# EAGLE design sequencer (EAGLE 5.11)
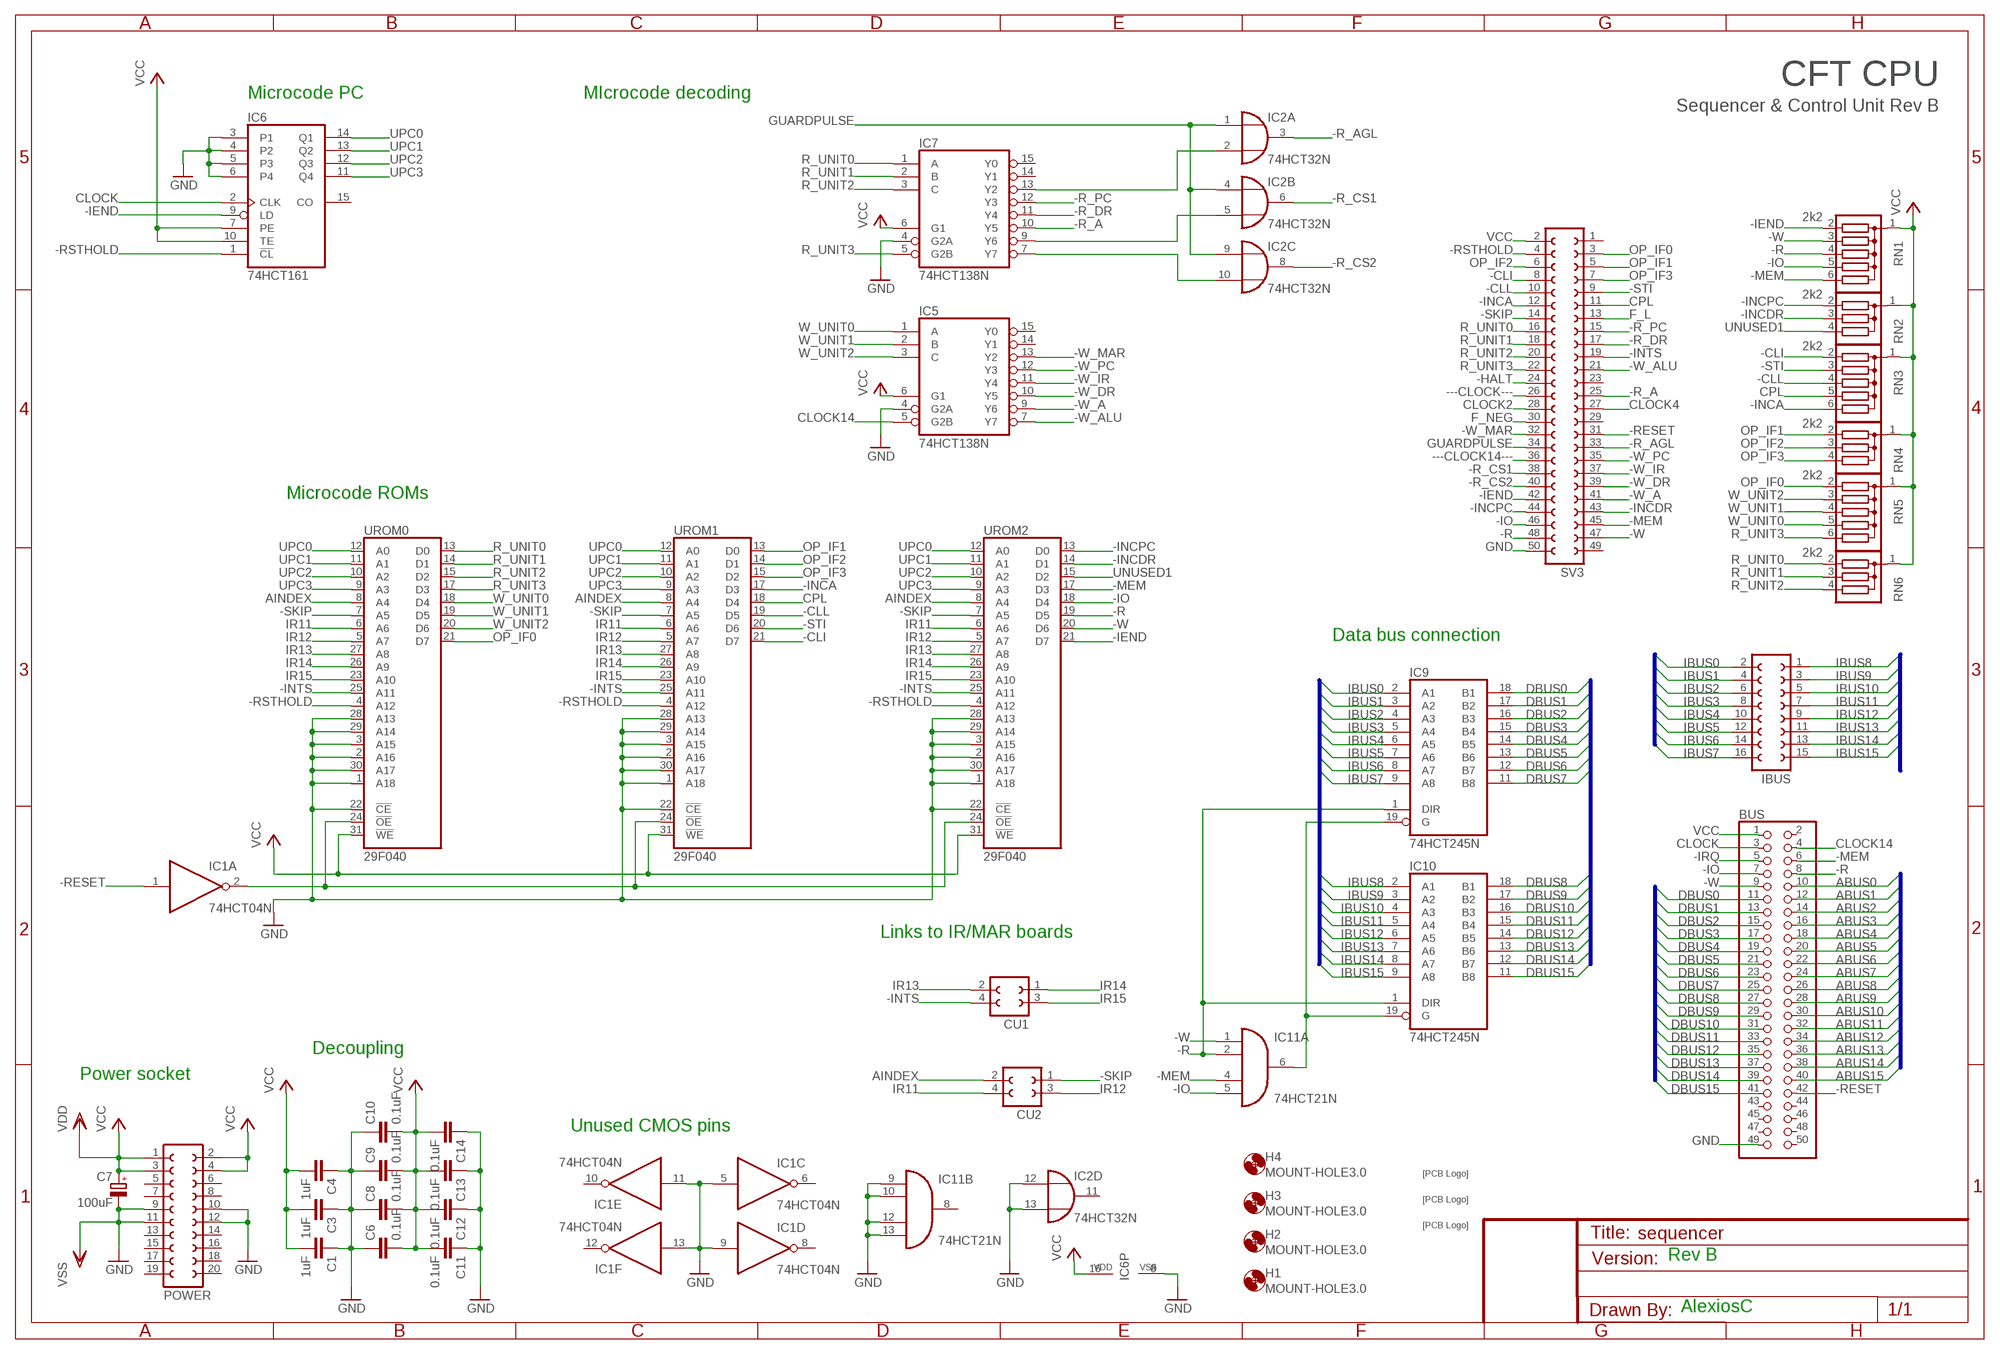
[diagram p0: schematic, sheet 1]

## Parts
BUS  PINHD-2X25/90  [2X25/90]
C1  1uF  C-EU025-025X050  [C025-025X050]
C3  1uF  C-EU025-025X050  [C025-025X050]
C4  1uF  C-EU025-025X050  [C025-025X050]
C6  0.1uF  C-EU025-025X050  [C025-025X050]
C7  100uF  CPOL-EUE2.5-6  [E2,5-6]
C8  0.1uF  C-EU025-025X050  [C025-025X050]
C9  0.1uF  C-EU025-025X050  [C025-025X050]
C10  0.1uF  C-EU025-025X050  [C025-025X050]
C11  0.1uF  C-EU025-025X050  [C025-025X050]
C12  0.1uF  C-EU025-025X050  [C025-025X050]
C13  0.1uF  C-EU025-025X050  [C025-025X050]
C14  0.1uF  C-EU025-025X050  [C025-025X050]
CU1  FE02-2  [FE02-2]
CU2  FE02-2  [FE02-2]
H1  MOUNT-HOLE3.0  [3,0]
H2  MOUNT-HOLE3.0  [3,0]
H3  MOUNT-HOLE3.0  [3,0]
H4  MOUNT-HOLE3.0  [3,0]
IBUS  FE08-2  [FE08-2]
IC1  74HCT04N  [DIL14]
IC2  74HCT32N  [DIL14]
IC5  74HCT138N  [DIL16]
IC6  74HCT161  4161P  [DIL16]
IC7  74HCT138N  [DIL16]
IC9  74HCT245N  [DIL20]
IC10  74HCT245N  [DIL20]
IC11  74HCT21N  [DIL14]
POWER  FE10-2  [FE10-2]
RN1  2k2  G05R  [SIL6]
RN2  2k2  G03R  [SIL4]
RN3  2k2  G05R  [SIL6]
RN4  2k2  G03R  [SIL4]
RN5  2k2  G05R  [SIL6]
RN6  2k2  G03R  [SIL4]
SV3  FE25-2  [FE25-2]
U$1  SIGNATUREPLANE  [SIGNATURE_PLANE]
U$2  SIGNATUREPLANE  [SIGNATURE_PLANE]
U$3  SIGNATURESILK  [SIGNATURE]
UROM0  29F040  29F040DIP32  [DIL32]
UROM1  29F040  29F040DIP32  [DIL32]
UROM2  29F040  29F040DIP32  [DIL32]

## Nets
---CLOCK14---: SV3.36
---CLOCK---: SV3.26
-CLI: RN3.2 SV3.8 UROM1.21(D7)
-CLL: RN3.4 SV3.10 UROM1.19(D5)
-HALT: SV3.24
-IEND: IC6.9(LD) RN1.2 SV3.42 UROM2.21(D7)
-INCA: RN3.6 SV3.12 UROM1.17(D3)
-INCDR: RN2.3 SV3.43 UROM2.14(D1)
-INCPC: RN2.2 SV3.44 UROM2.13(D0)
-INTS: CU1.4 SV3.19 UROM0.25(A11) UROM1.25(A11) UROM2.25(A11)
-IO: BUS.7 IC11.5(A:I3) RN1.5 SV3.46 UROM2.18(D4)
-IRQ: BUS.5
-MEM: BUS.6 IC11.4(A:I2) RN1.6 SV3.45 UROM2.17(D3)
-R: BUS.8 IC9.1(DIR) IC10.1(DIR) IC11.2(A:I1) RN1.4 SV3.48 UROM2.19(D5)
-R_A: IC7.10(Y5) SV3.25
-R_AGL: IC2.3(A:O) SV3.33
-R_CS1: IC2.6(B:O) SV3.38
-R_CS2: IC2.8(C:O) SV3.40
-R_DR: IC7.11(Y4) SV3.17
-R_PC: IC7.12(Y3) SV3.15
-RESET: BUS.42 IC1.1(A:I) SV3.31
-RSTHOLD: IC6.1(!CL) SV3.4 UROM0.4(A12) UROM1.4(A12) UROM2.4(A12)
-SKIP: CU2.1 SV3.14 UROM0.7(A5) UROM1.7(A5) UROM2.7(A5)
-STI: RN3.3 SV3.9 UROM1.20(D6)
-W: BUS.9 IC11.1(A:I0) RN1.3 SV3.47 UROM2.20(D6)
-W_A: IC5.9(Y6) SV3.41
-W_ALU: IC5.7(Y7) SV3.21
-W_DR: IC5.10(Y5) SV3.39
-W_IR: IC5.11(Y4) SV3.37
-W_MAR: IC5.13(Y2) SV3.32
-W_PC: IC5.12(Y3) SV3.35
ABUS0: BUS.10
ABUS1: BUS.12
ABUS2: BUS.14
ABUS3: BUS.16
ABUS4: BUS.18
ABUS5: BUS.20
ABUS6: BUS.22
ABUS7: BUS.24
ABUS8: BUS.26
ABUS9: BUS.28
ABUS10: BUS.30
ABUS11: BUS.32
ABUS12: BUS.34
ABUS13: BUS.36
ABUS14: BUS.38
ABUS15: BUS.40
AINDEX: CU2.2 UROM0.8(A4) UROM1.8(A4) UROM2.8(A4)
CLOCK: BUS.3 IC6.2(CLK)
CLOCK2: SV3.28
CLOCK4: SV3.27
CLOCK14: BUS.4 IC5.5(G2B)
CPL: RN3.5 SV3.11 UROM1.18(D4)
DBUS0: BUS.11 IC9.18(B1)
DBUS1: BUS.13 IC9.17(B2)
DBUS2: BUS.15 IC9.16(B3)
DBUS3: BUS.17 IC9.15(B4)
DBUS4: BUS.19 IC9.14(B5)
DBUS5: BUS.21 IC9.13(B6)
DBUS6: BUS.23 IC9.12(B7)
DBUS7: BUS.25 IC9.11(B8)
DBUS8: BUS.27 IC10.18(B1)
DBUS9: BUS.29 IC10.17(B2)
DBUS10: BUS.31 IC10.16(B3)
DBUS11: BUS.33 IC10.15(B4)
DBUS12: BUS.35 IC10.14(B5)
DBUS13: BUS.37 IC10.13(B6)
DBUS14: BUS.39 IC10.12(B7)
DBUS15: BUS.41 IC10.11(B8)
F_L: SV3.13
F_NEG: SV3.30
GND: BUS.49 C1.1 C3.1 C4.1 C6.1 C7.- C8.1 C9.1 C10.1 C11.1 C12.1 C13.1 C14.1 IC1.5(C:I) IC1.9(D:I) IC1.11(E:I) IC1.13(F:I) IC2.12(D:I0) IC2.13(D:I1) IC5.4(G2A) IC6.3(P1) IC6.4(P2) IC6.5(P3) IC6.6(P4) IC6.8(VSS) IC7.4(G2A) IC11.9(B:I0) IC11.10(B:I1) IC11.12(B:I2) IC11.13(B:I3) POWER.9 POWER.10 POWER.11 POWER.12 SV3.50 UROM0.1(A18) UROM0.2(A16) UROM0.3(A15) UROM0.22(!CE) UROM0.28(A13) UROM0.29(A14) UROM0.30(A17) UROM1.1(A18) UROM1.2(A16) UROM1.3(A15) UROM1.22(!CE) UROM1.28(A13) UROM1.29(A14) UROM1.30(A17) UROM2.1(A18) UROM2.2(A16) UROM2.3(A15) UROM2.22(!CE) UROM2.28(A13) UROM2.29(A14) UROM2.30(A17) ; supply symbol labelled VSS
GUARDPULSE: IC2.1(A:I0) IC2.4(B:I0) IC2.9(C:I0) SV3.34
IBUS0: IBUS.2 IC9.2(A1)
IBUS1: IBUS.4 IC9.3(A2)
IBUS2: IBUS.6 IC9.4(A3)
IBUS3: IBUS.8 IC9.5(A4)
IBUS4: IBUS.10 IC9.6(A5)
IBUS5: IBUS.12 IC9.7(A6)
IBUS6: IBUS.14 IC9.8(A7)
IBUS7: IBUS.16 IC9.9(A8)
IBUS8: IBUS.1 IC10.2(A1)
IBUS9: IBUS.3 IC10.3(A2)
IBUS10: IBUS.5 IC10.4(A3)
IBUS11: IBUS.7 IC10.5(A4)
IBUS12: IBUS.9 IC10.6(A5)
IBUS13: IBUS.11 IC10.7(A6)
IBUS14: IBUS.13 IC10.8(A7)
IBUS15: IBUS.15 IC10.9(A8)
IR11: CU2.4 UROM0.6(A6) UROM1.6(A6) UROM2.6(A6)
IR12: CU2.3 UROM0.5(A7) UROM1.5(A7) UROM2.5(A7)
IR13: CU1.2 UROM0.27(A8) UROM1.27(A8) UROM2.27(A8)
IR14: CU1.1 UROM0.26(A9) UROM1.26(A9) UROM2.26(A9)
IR15: CU1.3 UROM0.23(A10) UROM1.23(A10) UROM2.23(A10)
N$1: IC1.2(A:O) UROM0.24(!OE) UROM1.24(!OE) UROM2.24(!OE)
N$2: IC9.19(G) IC10.19(G) IC11.6(A:O)
N$3: IC2.2(A:I1) IC7.13(Y2)
N$4: IC2.5(B:I1) IC7.9(Y6)
N$7: IC2.10(C:I1) IC7.7(Y7)
OP_IF0: RN5.2 SV3.3 UROM0.21(D7)
OP_IF1: RN4.2 SV3.5 UROM1.13(D0)
OP_IF2: RN4.3 SV3.6 UROM1.14(D1)
OP_IF3: RN4.4 SV3.7 UROM1.15(D2)
R_UNIT0: IC7.1(A) RN6.2 SV3.16 UROM0.13(D0)
R_UNIT1: IC7.2(B) RN6.3 SV3.18 UROM0.14(D1)
R_UNIT2: IC7.3(C) RN6.4 SV3.20 UROM0.15(D2)
R_UNIT3: IC7.5(G2B) RN5.6 SV3.22 UROM0.17(D3)
UNUSED1: RN2.4 UROM2.15(D2)
UPC0: IC6.14(Q1) UROM0.12(A0) UROM1.12(A0) UROM2.12(A0)
UPC1: IC6.13(Q2) UROM0.11(A1) UROM1.11(A1) UROM2.11(A1)
UPC2: IC6.12(Q3) UROM0.10(A2) UROM1.10(A2) UROM2.10(A2)
UPC3: IC6.11(Q4) UROM0.9(A3) UROM1.9(A3) UROM2.9(A3)
VCC: BUS.1 C1.2 C3.2 C4.2 C6.2 C7.+ C8.2 C9.2 C10.2 C11.2 C12.2 C13.2 C14.2 IC5.6(G1) IC6.7(PE) IC6.10(TE) IC6.16(VDD) IC7.6(G1) POWER.1 POWER.2 POWER.3 POWER.4 RN1.1 RN2.1 RN3.1 RN4.1 RN5.1 RN6.1 SV3.2 UROM0.31(!WE) UROM1.31(!WE) UROM2.31(!WE) ; supply symbol labelled VDD
W_UNIT0: IC5.1(A) RN5.5 UROM0.18(D4)
W_UNIT1: IC5.2(B) RN5.4 UROM0.19(D5)
W_UNIT2: IC5.3(C) RN5.3 UROM0.20(D6)
Unconnected: BUS.2 BUS.43 BUS.44 BUS.45 BUS.46 BUS.47 BUS.48 BUS.50 IC1.3(B:I) IC1.4(B:O) IC1.6(C:O) IC1.8(D:O) IC1.10(E:O) IC1.12(F:O) IC2.11(D:O) IC5.14(Y1) IC5.15(Y0) IC6.15(CO) IC7.14(Y1) IC7.15(Y0) IC11.8(B:O) POWER.5 POWER.6 POWER.7 POWER.8 POWER.13 POWER.14 POWER.15 POWER.16 POWER.17 POWER.18 POWER.19 POWER.20 SV3.1 SV3.23 SV3.29 SV3.49

## Buses
ABUS[0..15]
DBUS[0..15]
IBUS[0..15]

## Notes on the sheet
- CFT CPU
- Microcode PC | MIcrocode decoding
- Sequencer & Control Unit Rev B
- Microcode ROMs
- Data bus connection
- Links to IR/MAR boards
- Decoupling
- Power socket
- Unused CMOS pins
- Rev B
- AlexiosC

## Power pins joined to a net without a drawn wire
GND: IC1.7(P:GND) IC2.7(P:GND) IC5.8(GND) IC7.8(GND) IC9.10(GND) IC10.10(GND) IC11.7(P:GND) UROM0.16(GND) UROM1.16(GND) UROM2.16(GND)
VCC: IC1.14(P:VCC) IC2.14(P:VCC) IC5.16(VCC) IC7.16(VCC) IC9.20(VCC) IC10.20(VCC) IC11.14(P:VCC) UROM0.32(VCC) UROM1.32(VCC) UROM2.32(VCC)

## Library data of the parts
BUS = pinhead:PINHD-2X25: PIN HEADER
C1 C3 C4 C6 C8-C14 = rcl:C-EU: CAPACITOR, European symbol
C7 = rcl:CPOL-EU: POLARIZED CAPACITOR, European symbol
CU1 CU2 = alexios:FE02-2: A 2x2 pin female header.
H1-H4 = holes:MOUNT-HOLE: MOUNTING HOLE with drill center marker
IBUS = con-lsta:FE08-2: FEMALE HEADER
IC1 = 74xx-eu:74*04: Hex INVERTER
IC2 = 74xx-eu:74*32: Quad 2-input OR gate
IC5 IC7 = 74xx-eu:74*138: 3-line to 8-line DECODER/DEMULTIPLEXER
IC6 = 41xx:4161: 41xx DEVICE
IC9 IC10 = 74xx-eu:74*245: Octal BUS TRANSCEIVER, 3-state
IC11 = 74xx-eu:74*21: Dual 4-input AND gate
POWER = con-lsta:FE10-2: FEMALE HEADER; OC_FARNELL: unknown; OC_NEWARK: unknown
RN1 RN3 RN5 = resistor-sil:G05R: SIL RESISTOR; OC_FARNELL: unknown; OC_NEWARK: unknown
RN2 RN4 RN6 = resistor-sil:G03R: SIL RESISTOR; OC_FARNELL: unknown; OC_NEWARK: unknown
SV3 = con-lsta:FE25-2: FEMALE HEADER
U$1-U$3 = alexios:SIGNATURE: Soup signature
UROM0 UROM1 UROM2 = alexios:29F040: 4-mbit (512x8) Flash memory in a PLCC32 package (with socket). AM29F040 is an example of this.

## Net classes
0 default: width 0.406 mm, clearance 0.305 mm
1 Decoupling: width 1.27 mm

## Board
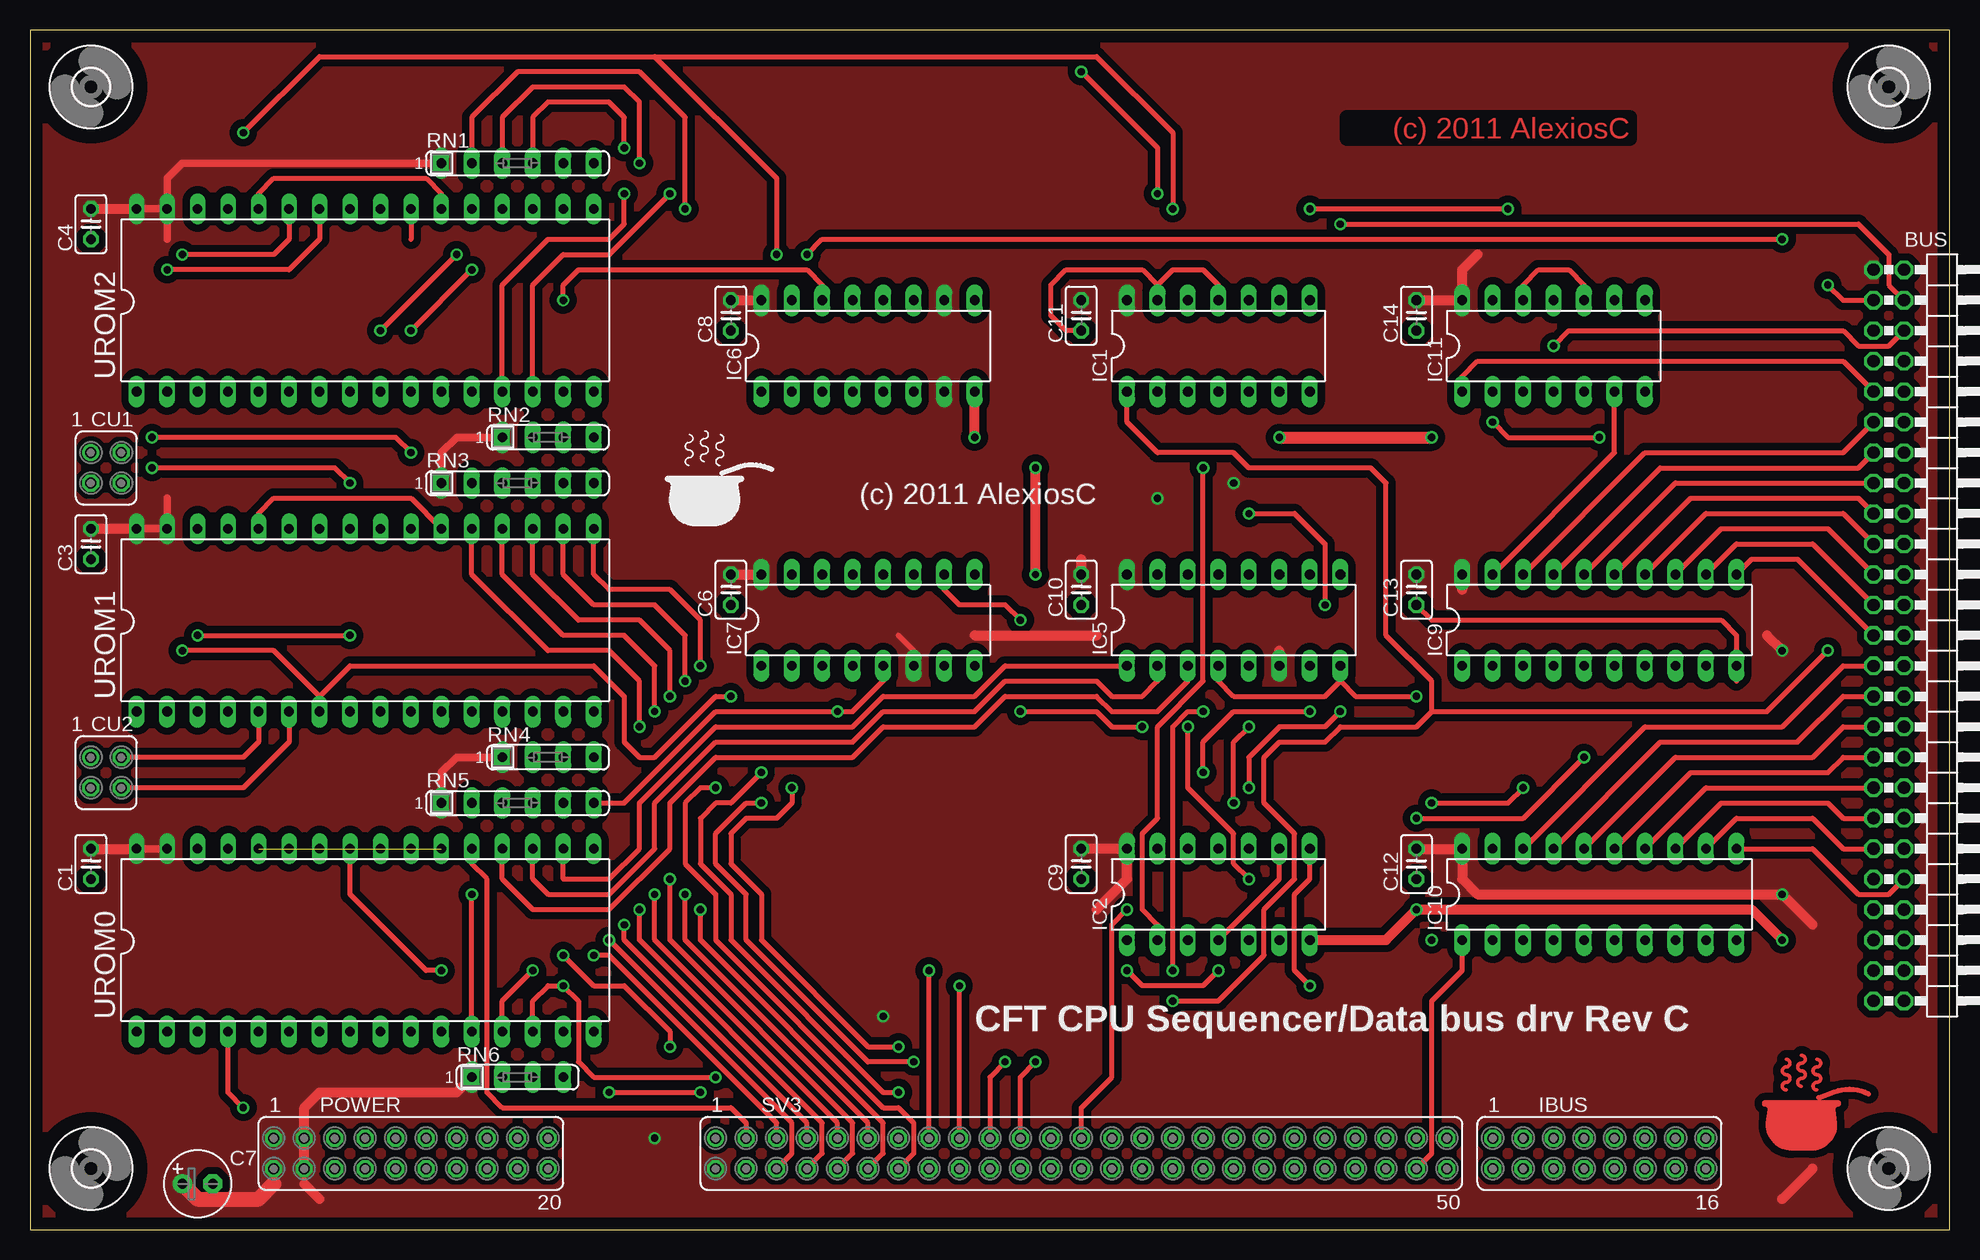
[diagram p1: board, top side]
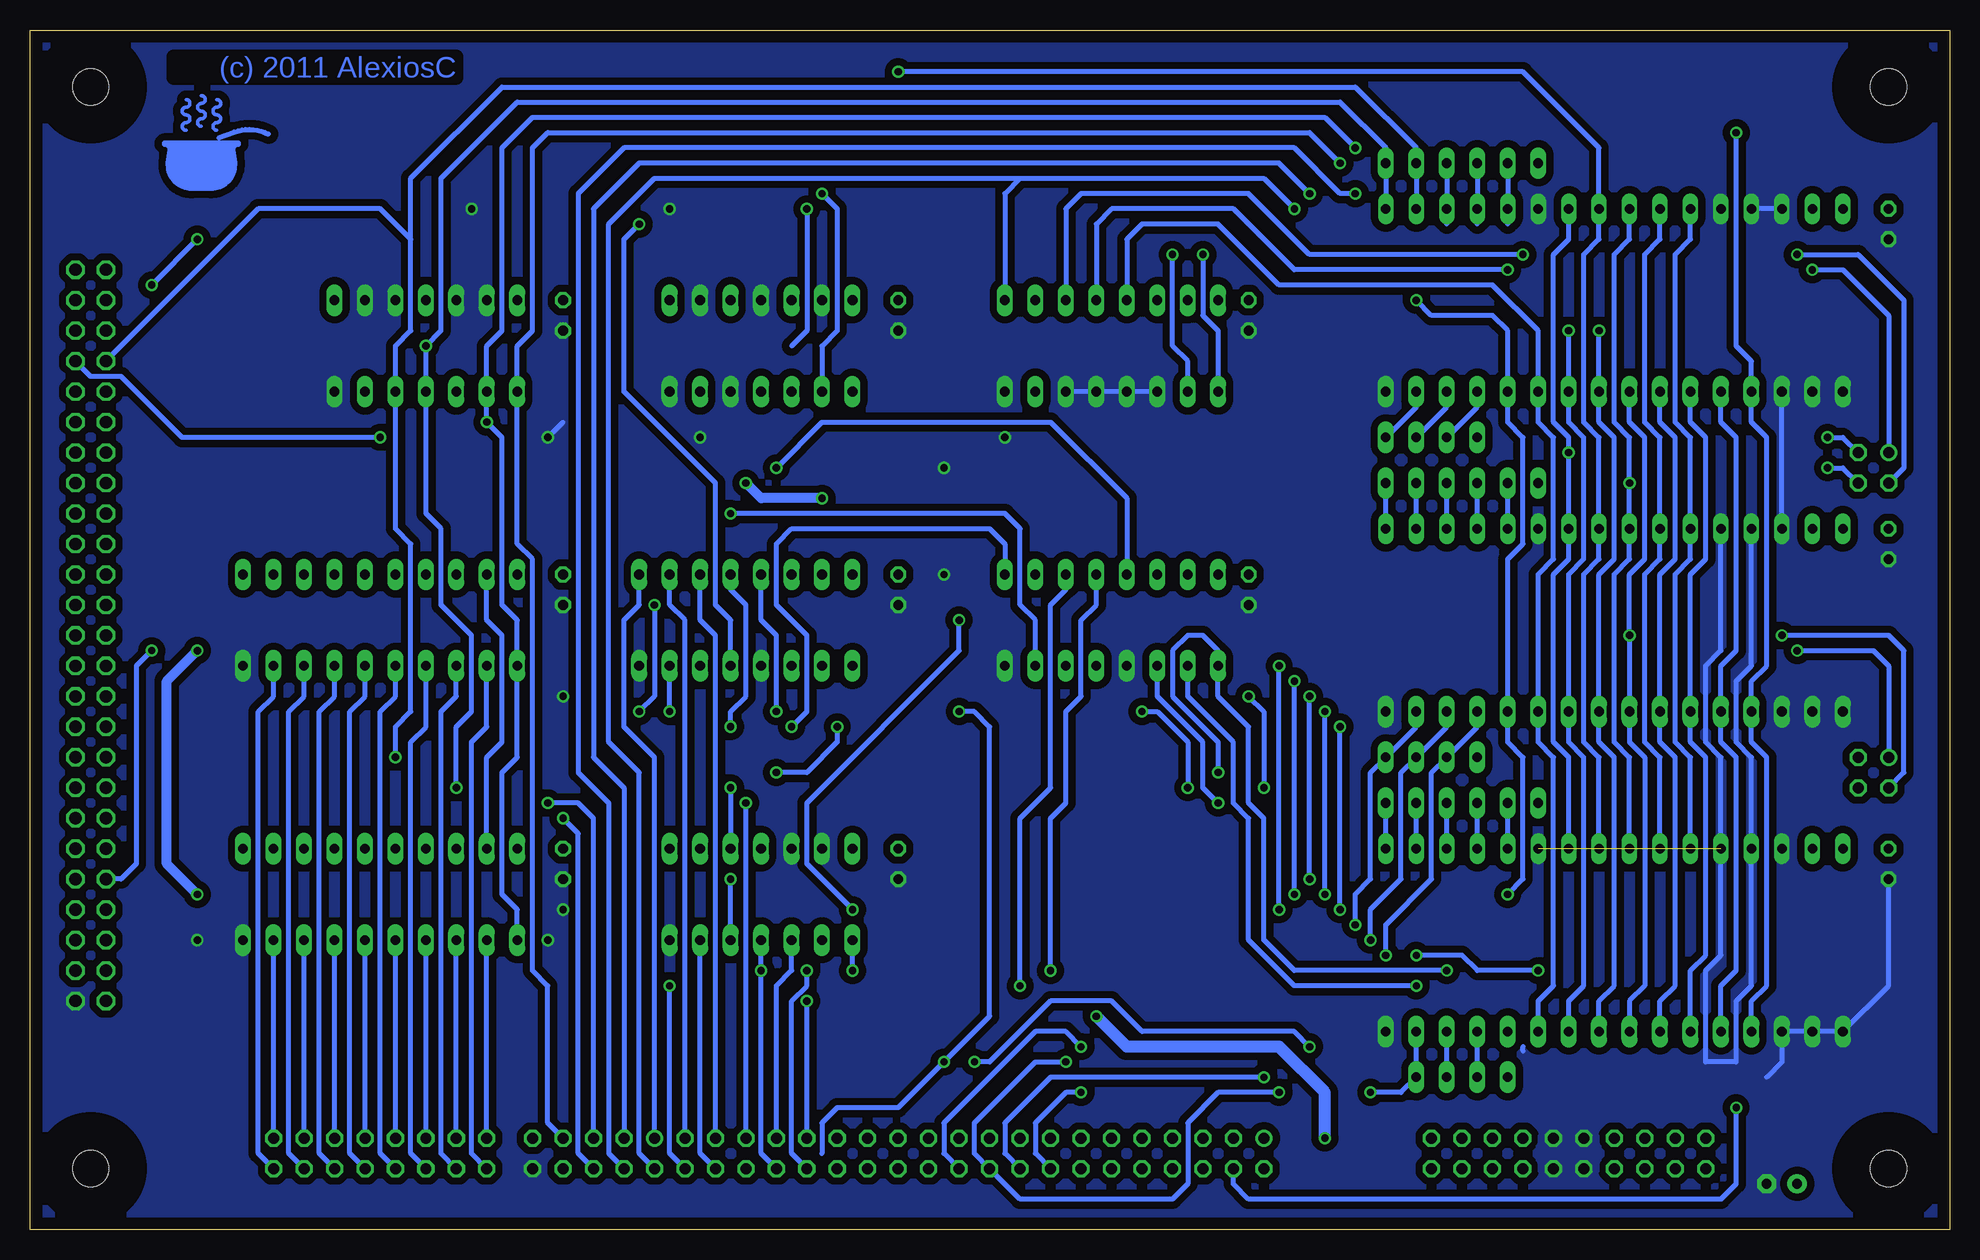
[diagram p2: board, bottom side, seen from below]

Size 160 x 100 mm. Coordinates in mm from the lower left corner, seen from the top.
Outline: 0,0 160,0 160,100 0,100 0,0
Copper layers (1*16): Top 0.035mm / dielectric 1.5mm / Bottom 0.035mm
Design rules "olimex-10mil": minimum track width 10mil, minimum drill 24mil, track to track 10mil, track to pad 10mil, pad to pad 10mil, via to via 10mil, smd to smd 10mil, copper to edge 40mil, drill to drill 10mil, minimum pad ring 10mil, minimum via ring 8mil, stop-mask expansion 0mil, vias tented up to drill 0mil, thermal gap 10mil

### Footprints (pad centres in the part's own frame; a part is rotated, then mirrored left to right if it is on the bottom)
2X25/90 = drill 1.016 octagon: 1 -29.21,-6.35; 2 -29.21,-3.81; 3 -26.67,-6.35; 4 -26.67,-3.81; 5 -24.13,-6.35; 6 -24.13,-3.81; 7 -21.59,-6.35; 8 -21.59,-3.81; 9 -19.05,-6.35; 10 -19.05,-3.81; 11 -16.51,-6.35; 12 -16.51,-3.81; 13 -13.97,-6.35; 14 -13.97,-3.81; 15 -11.43,-6.35; 16 -11.43,-3.81; 17 -8.89,-6.35; 18 -8.89,-3.81; 19 -6.35,-6.35; 20 -6.35,-3.81; 21 -3.81,-6.35; 22 -3.81,-3.81; 23 -1.27,-6.35; 24 -1.27,-3.81; 25 1.27,-6.35; 26 1.27,-3.81; 27 3.81,-6.35; 28 3.81,-3.81; 29 6.35,-6.35; 30 6.35,-3.81; 31 8.89,-6.35; 32 8.89,-3.81; 33 11.43,-6.35; 34 11.43,-3.81; 35 13.97,-6.35; 36 13.97,-3.81; 37 16.51,-6.35; 38 16.51,-3.81; 39 19.05,-6.35; 40 19.05,-3.81; 41 21.59,-3.81; 42 21.59,-6.35; 43 24.13,-3.81; 44 24.13,-6.35; 45 26.67,-3.81; 46 26.67,-6.35; 47 29.21,-3.81; 48 29.21,-6.35; 49 31.75,-3.81; 50 31.75,-6.35
C025-025X050 = drill 0.813 octagon: 1 -1.27,0; 2 1.27,0
E2,5-6 = drill 0.813 pad 1.6 round: + -1.27,0 | drill 0.813 pad 1.6 octagon: - 1.27,0
FE02-2 = drill 0.914 round: 1 -1.27,1.27 | drill 0.914 octagon: 2 -1.27,-1.27; 3 1.27,1.27; 4 1.27,-1.27
3,0 = hole 3: 0,0
FE08-2 = drill 0.914 octagon: 1 -8.89,1.27; 2 -8.89,-1.27; 3 -6.35,1.27; 4 -6.35,-1.27; 5 -3.81,1.27; 6 -3.81,-1.27; 7 -1.27,1.27; 8 -1.27,-1.27; 9 1.27,1.27; 10 1.27,-1.27; 11 3.81,1.27; 12 3.81,-1.27; 13 6.35,1.27; 14 6.35,-1.27; 15 8.89,1.27; 16 8.89,-1.27
DIL14 = drill 0.813 long: 1 -7.62,-3.81; 2 -5.08,-3.81; 3 -2.54,-3.81; 4 0,-3.81; 5 2.54,-3.81; 6 5.08,-3.81; 7 7.62,-3.81; 8 7.62,3.81; 9 5.08,3.81; 10 2.54,3.81; 11 0,3.81; 12 -2.54,3.81; 13 -5.08,3.81; 14 -7.62,3.81
DIL16 = drill 0.813 long: 1 -8.89,-3.81; 2 -6.35,-3.81; 3 -3.81,-3.81; 4 -1.27,-3.81; 5 1.27,-3.81; 6 3.81,-3.81; 7 6.35,-3.81; 8 8.89,-3.81; 9 8.89,3.81; 10 6.35,3.81; 11 3.81,3.81; 12 1.27,3.81; 13 -1.27,3.81; 14 -3.81,3.81; 15 -6.35,3.81; 16 -8.89,3.81
DIL20 = drill 0.813 long: 1 -11.43,-3.81; 2 -8.89,-3.81; 3 -6.35,-3.81; 4 -3.81,-3.81; 5 -1.27,-3.81; 6 1.27,-3.81; 7 3.81,-3.81; 8 6.35,-3.81; 9 8.89,-3.81; 10 11.43,-3.81; 11 11.43,3.81; 12 8.89,3.81; 13 6.35,3.81; 14 3.81,3.81; 15 1.27,3.81; 16 -1.27,3.81; 17 -3.81,3.81; 18 -6.35,3.81; 19 -8.89,3.81; 20 -11.43,3.81
FE10-2 = drill 0.914 octagon: 1 -11.43,1.27; 2 -11.43,-1.27; 3 -8.89,1.27; 4 -8.89,-1.27; 5 -6.35,1.27; 6 -6.35,-1.27; 7 -3.81,1.27; 8 -3.81,-1.27; 9 -1.27,1.27; 10 -1.27,-1.27; 11 1.27,1.27; 12 1.27,-1.27; 13 3.81,1.27; 14 3.81,-1.27; 15 6.35,1.27; 16 6.35,-1.27; 17 8.89,1.27; 18 8.89,-1.27; 19 11.43,1.27; 20 11.43,-1.27
SIL6 = drill 0.813 long: 1 -6.35,0; 2 -3.81,0; 3 -1.27,0; 4 1.27,0; 5 3.81,0; 6 6.35,0
SIL4 = drill 0.813 long: 1 -3.81,0; 2 -1.27,0; 3 1.27,0; 4 3.81,0
FE25-2 = drill 0.914 round: 1 -30.48,1.27; 41 20.32,1.27 | drill 0.914 octagon: 2 -30.48,-1.27; 3 -27.94,1.27; 4 -27.94,-1.27; 5 -25.4,1.27; 6 -25.4,-1.27; 7 -22.86,1.27; 8 -22.86,-1.27; 9 -20.32,1.27; 10 -20.32,-1.27; 11 -17.78,1.27; 12 -17.78,-1.27; 13 -15.24,1.27; 14 -15.24,-1.27; 15 -12.7,1.27; 16 -12.7,-1.27; 17 -10.16,1.27; 18 -10.16,-1.27; 19 -7.62,1.27; 20 -7.62,-1.27; 21 -5.08,1.27; 22 -5.08,-1.27; 23 -2.54,1.27; 24 -2.54,-1.27; 25 0,1.27; 26 0,-1.27; 27 2.54,1.27; 28 2.54,-1.27; 29 5.08,1.27; 30 5.08,-1.27; 31 7.62,1.27; 32 7.62,-1.27; 33 10.16,1.27; 34 10.16,-1.27; 35 12.7,1.27; 36 12.7,-1.27; 37 15.24,1.27; 38 15.24,-1.27; 39 17.78,1.27; 40 17.78,-1.27; 42 20.32,-1.27; 43 22.86,1.27; 44 22.86,-1.27; 45 25.4,1.27; 46 25.4,-1.27; 47 27.94,1.27; 48 27.94,-1.27; 49 30.48,1.27; 50 30.48,-1.27
DIL32 = drill 0.813 long: 1 -19.05,-7.62; 2 -16.51,-7.62; 3 -13.97,-7.62; 4 -11.43,-7.62; 5 -8.89,-7.62; 6 -6.35,-7.62; 7 -3.81,-7.62; 8 -1.27,-7.62; 9 1.27,-7.62; 10 3.81,-7.62; 11 6.35,-7.62; 12 8.89,-7.62; 13 11.43,-7.62; 14 13.97,-7.62; 15 16.51,-7.62; 16 19.05,-7.62 | drill 0.8 long: 17 19.05,7.62; 18 16.51,7.62; 19 13.97,7.62; 20 11.43,7.62; 21 8.89,7.62; 22 6.35,7.62; 23 3.81,7.62; 24 1.27,7.62; 25 -1.27,7.62; 26 -3.81,7.62; 27 -6.35,7.62; 28 -8.89,7.62; 29 -11.43,7.62; 30 -13.97,7.62; 31 -16.51,7.62; 32 -19.05,7.62

### Placement (x,y rotation side)
BUS  160.02,50.8 270 top
C1  5.08,30.48 90 top
C3  5.08,57.15 90 top
C4  5.08,83.82 90 top
C6  58.42,53.34 90 top
C7  13.97,3.81 0 top
C8  58.42,76.2 90 top
C9  87.63,30.48 90 top
C10  87.63,53.34 90 top
C11  87.63,76.2 90 top
C12  115.57,30.48 90 top
C13  115.57,53.34 90 top
C14  115.57,76.2 90 top
CU1  6.35,63.5 0 top
CU2  6.35,38.1 0 top
H1  154.94,95.25 0 top
H2  154.94,5.08 0 top
H3  5.08,5.08 0 top
H4  5.08,95.25 0 top
IBUS  130.81,6.35 0 top
IC1  99.06,73.66 0 top
IC2  99.06,27.94 0 top
IC5  100.33,50.8 0 top
IC6  69.85,73.66 0 top
IC7  69.85,50.8 0 top
IC9  130.81,50.8 0 top
IC10  130.81,27.94 0 top
IC11  127,73.66 0 top
POWER  31.75,6.35 0 top
RN1  40.64,88.9 0 top
RN2  43.18,66.04 0 top
RN3  40.64,62.23 0 top
RN4  43.18,39.37 0 top
RN5  40.64,35.56 0 top
RN6  40.64,12.7 0 top
SV3  87.63,6.35 0 top
U$1  144.78,6.35 0 top
U$2  148.59,86.36 0 bottom
U$3  53.34,58.42 0 top
UROM0  27.94,24.13 0 top
UROM1  27.94,50.8 0 top
UROM2  27.94,77.47 0 top

### Tracks (layer width: path | path; a pad name or v marks a point on that pad's centre or on a via)
-CLI  (via drill 0.61)
  Top 0.406: UROM1.21 36.83,54.61 43.18,48.26 48.26,48.26 50.8,45.72 v50.8,41.91 | v50.8,26.67 50.8,24.13 66.04,8.89 66.04,6.35 SV3.8
  Bottom 0.406: UROM1.21 RN3.2 | v50.8,26.67 v50.8,41.91
-CLL  (via drill 0.61)
  Top 0.406: UROM1.19 41.91,54.61 45.72,50.8 50.8,50.8 53.34,48.26 v53.34,44.45 | v53.34,29.21 53.34,24.13 68.58,8.89 68.58,6.35 SV3.10
  Bottom 0.406: UROM1.19 RN3.4 | v53.34,29.21 v53.34,44.45
-IEND  (via drill 0.61)
  Top 0.406: v54.61,85.09 54.61,92.71 50.8,96.52 40.64,96.52 36.83,92.71 RN1.2
  Bottom 0.406: RN1.2 UROM2.21 36.83,83.82 | v54.61,85.09 57.15,87.63 77.47,87.63 | 77.47,87.63 78.74,86.36 IC6.9 | 77.47,87.63 107.95,87.63 111.76,83.82 111.76,40.64 109.22,38.1 109.22,6.35 SV3.42
-INCA  (via drill 0.61)
  Top 0.406: UROM1.17 46.99,54.61 48.26,53.34 53.34,53.34 55.88,50.8 v55.88,46.99 | v55.88,26.67 55.88,24.13 71.12,8.89 71.12,6.35 SV3.12
  Bottom 0.406: UROM1.17 RN3.6 | v55.88,26.67 v55.88,46.99
-INCDR  (via drill 0.61)
  Top 0.406: v53.34,86.36 48.26,81.28 44.45,81.28 41.91,78.74 UROM2.14
  Bottom 0.406: UROM2.14 41.91,68.58 RN2.3 | v53.34,86.36 55.88,88.9 109.22,88.9 113.03,85.09 113.03,39.37 110.49,36.83 SV3.43
-INCPC  (via drill 0.61)
  Top 0.406: v49.53,86.36 49.53,83.82 48.26,82.55 43.18,82.55 39.37,78.74 UROM2.13
  Bottom 0.406: UROM2.13 39.37,68.58 RN2.2 | v49.53,86.36 50.8,86.36 54.61,90.17 110.49,90.17 114.3,86.36 114.3,38.1 111.76,35.56 111.76,6.35 SV3.44
-INTS  (via drill 0.6, 0.61)
  Top 0.406: v10.16,63.5 25.4,63.5 v26.67,62.23 | UROM0.25 26.67,27.94 33.02,21.59 v34.29,21.59 | v44.45,22.86 46.99,20.32 49.53,20.32 53.34,16.51 v53.34,15.24 | v81.28,13.97 80.01,12.7 SV3.19
  Bottom 0.406: UROM2.25 26.67,82.55 27.94,81.28 27.94,67.31 26.67,66.04 v26.67,62.23 UROM1.25 26.67,55.88 27.94,54.61 27.94,40.64 26.67,39.37 UROM0.25 | v10.16,63.5 8.89,63.5 CU1.4 | v34.29,21.59 39.37,21.59 40.64,22.86 v44.45,22.86 | v53.34,15.24 54.61,16.51 67.31,16.51 69.85,19.05 74.93,19.05 80.01,13.97 v81.28,13.97
-IO  (via drill 0.61)
  Top 0.406: v129.54,39.37 124.46,34.29 v115.57,34.29
  Bottom 0.406: UROM2.18 RN1.5 44.45,90.17 49.53,95.25 120.65,95.25 128.27,87.63 128.27,82.55 | 128.27,82.55 128.27,74.93 129.54,73.66 IC11.5 129.54,58.42 128.27,57.15 128.27,43.18 129.54,41.91 v129.54,39.37 | v115.57,34.29 114.3,33.02 114.3,6.35 SV3.46 | 128.27,82.55 130.81,85.09 140.97,85.09 BUS.7
-MEM  (via drill 0.61)
  Top 0.406: v127,73.66 128.27,74.93 151.13,74.93 152.4,73.66 154.94,73.66 BUS.6 | v124.46,36.83 123.19,35.56 v116.84,35.56
  Bottom 0.406: UROM2.17 RN1.6 46.99,90.17 50.8,93.98 119.38,93.98 125.73,87.63 125.73,74.93 v127,73.66 IC11.4 127,59.69 125.73,58.42 125.73,52.07 123.19,49.53 123.19,43.18 124.46,41.91 v124.46,36.83 | v116.84,35.56 114.3,35.56 113.03,34.29 SV3.45
-R  (via drill 0.61)
  Top 0.406: IC10.1 119.38,21.59 116.84,19.05 116.84,6.35 SV3.48 | RN1.4 41.91,92.71 43.18,93.98 48.26,93.98 49.53,92.71 v49.53,90.17 | v121.92,67.31 123.19,66.04 v130.81,66.04
  Bottom 0.406: RN1.4 UROM2.19 41.91,83.82 | IC10.1 119.38,26.67 120.65,27.94 120.65,38.1 119.38,39.37 IC9.1 119.38,50.8 120.65,52.07 120.65,66.04 v121.92,67.31 IC11.2 121.92,73.66 120.65,74.93 120.65,90.17 118.11,92.71 52.07,92.71 v49.53,90.17 | v130.81,66.04 147.32,66.04 152.4,71.12 154.94,71.12 BUS.8
-R_A  (via drill 0.61)
  Top 0.406: v91.44,26.67 90.17,25.4 90.17,12.7 87.63,10.16 SV3.25 | v82.55,50.8 81.28,52.07 77.47,52.07 76.2,53.34 IC7.10
  Bottom 0.406: v91.44,26.67 95.25,30.48 95.25,35.56 82.55,48.26 v82.55,50.8
-R_AGL
  Bottom 0.406: IC2.3 96.52,21.59 97.79,20.32 SV3.33
-R_CS1
  Bottom 0.406: IC2.6 104.14,6.35 SV3.38
-R_CS2  (via drill 0.61)
  Top 0.406: IC2.8 106.68,29.21 105.41,27.94 105.41,21.59 v106.68,20.32
  Bottom 0.406: v106.68,20.32 106.68,6.35 SV3.40
-R_DR  (via drill 0.6)
  Top 0.406: SV3.17 v77.47,20.32
  Bottom 0.406: IC7.11 73.66,53.34 74.93,52.07 74.93,36.83 77.47,34.29 v77.47,20.32
-R_PC  (via drill 0.61)
  Top 0.406: SV3.15 v74.93,21.59
  Bottom 0.406: IC7.12 71.12,52.07 72.39,50.8 72.39,44.45 73.66,43.18 73.66,35.56 74.93,34.29 v74.93,21.59
-RESET  (via drill 0.6, 0.61)
  Top 0.406: v95.25,19.05 99.06,19.05 102.87,22.86 102.87,26.67 105.41,29.21 105.41,33.02 102.87,35.56 102.87,39.37 104.14,40.64 107.95,40.64 109.22,41.91 115.57,41.91 116.84,43.18 | IC1.1 91.44,67.31 93.98,64.77 100.33,64.77 101.6,63.5 111.76,63.5 113.03,62.23 113.03,49.53 116.84,45.72 116.84,43.18 | 116.84,43.18 144.78,43.18 v149.86,48.26
  Bottom 0.406: SV3.31 v95.25,19.05 | v149.86,48.26 151.13,46.99 151.13,30.48 152.4,29.21 BUS.42
-RSTHOLD  (via drill 0.6, 0.61)
  Top 0.406: v95.25,85.09 95.25,91.44 88.9,97.79 52.07,97.79 | v17.78,91.44 24.13,97.79 52.07,97.79 | v62.23,81.28 62.23,87.63 52.07,97.79 | v17.78,10.16 16.51,11.43 UROM0.4
  Bottom 0.406: UROM0.4 16.51,19.05 15.24,20.32 15.24,39.37 16.51,40.64 UROM1.4 16.51,45.72 15.24,46.99 15.24,66.04 16.51,67.31 UROM2.4 16.51,72.39 17.78,73.66 v17.78,91.44 | 96.52,73.66 95.25,74.93 v95.25,85.09 | IC6.1 60.96,74.93 62.23,76.2 v62.23,81.28 | v17.78,10.16 17.78,3.81 19.05,2.54 58.42,2.54 59.69,3.81 SV3.4
-SKIP  (via drill 0.61)
  Top 0.406: v57.15,36.83 55.88,36.83 54.61,35.56 54.61,30.48 57.15,27.94 57.15,24.13 71.12,10.16 72.39,10.16 73.66,8.89 73.66,6.35 SV3.14 | v58.42,44.45 57.15,44.45 52.07,39.37 50.8,39.37 49.53,40.64 49.53,44.45 46.99,46.99 26.67,46.99 24.13,44.45 | UROM1.7 24.13,44.45 | v12.7,48.26 20.32,48.26 24.13,44.45
  Bottom 0.406: UROM0.7 24.13,19.05 22.86,20.32 22.86,39.37 24.13,40.64 UROM1.7 24.13,54.61 22.86,55.88 22.86,66.04 24.13,67.31 UROM2.7 | v57.15,36.83 57.15,43.18 v58.42,44.45 | v12.7,48.26 6.35,48.26 5.08,46.99 CU2.1
-STI  (via drill 0.61)
  Top 0.406: UROM1.20 39.37,54.61 44.45,49.53 49.53,49.53 52.07,46.99 v52.07,43.18 | v52.07,27.94 52.07,24.13 67.31,8.89 SV3.9
  Bottom 0.406: UROM1.20 RN3.3 | v52.07,27.94 v52.07,43.18
-W  (via drill 0.61)
  Top 0.406: IC11.1 119.38,71.12 120.65,72.39 151.13,72.39 BUS.9 | v50.8,88.9 50.8,93.98 49.53,95.25 41.91,95.25 39.37,92.71 RN1.3
  Bottom 0.406: RN1.3 UROM2.20 39.37,83.82 | v50.8,88.9 53.34,91.44 116.84,91.44 118.11,90.17 118.11,74.93 119.38,73.66 IC11.1 119.38,57.15 118.11,55.88 118.11,21.59 116.84,20.32 116.84,8.89 SV3.47
-W_A
  Bottom 0.406: IC5.9 109.22,52.07 110.49,50.8 110.49,41.91 107.95,39.37 SV3.41
-W_ALU  (via drill 0.6)
  Top 0.406: v82.55,43.18 88.9,43.18 90.17,41.91 v92.71,41.91 | v97.79,38.1 97.79,40.64 100.33,43.18 v106.68,43.18 | SV3.21 82.55,12.7 v83.82,13.97
  Bottom 0.406: v92.71,41.91 92.71,40.64 95.25,38.1 v97.79,38.1 | v106.68,43.18 IC5.7 | v82.55,43.18 81.28,43.18 80.01,41.91 80.01,17.78 v83.82,13.97 87.63,10.16 92.71,10.16 93.98,8.89 93.98,6.35
-W_DR
  Bottom 0.406: IC5.10 106.68,52.07 105.41,50.8 SV3.39
-W_IR
  Bottom 0.406: IC5.11 104.14,50.8 102.87,49.53 SV3.37
-W_MAR  (via drill 0.61)
  Top 0.406: v97.79,43.18 96.52,43.18 95.25,41.91 v95.25,21.59
  Bottom 0.406: IC5.13 99.06,50.8 97.79,49.53 v97.79,43.18 | v95.25,21.59 95.25,20.32 96.52,19.05 96.52,6.35 SV3.32
-W_PC  (via drill 0.61)
  Top 0.406: v100.33,35.56 100.33,40.64 v101.6,41.91
  Bottom 0.406: IC5.12 101.6,53.34 100.33,52.07 100.33,44.45 101.6,43.18 v101.6,41.91 | SV3.35 v100.33,35.56
AINDEX  (via drill 0.61)
  Top 0.406: v13.97,49.53 v26.67,49.53
  Bottom 0.406: UROM0.8 26.67,19.05 25.4,20.32 25.4,39.37 26.67,40.64 UROM1.8 v26.67,49.53 26.67,54.61 25.4,55.88 25.4,66.04 26.67,67.31 UROM2.8 | v13.97,49.53 5.08,49.53 3.81,48.26 3.81,38.1 CU2.2
CLOCK  (via drill 0.61)
  Top 0.406: v146.05,82.55 66.04,82.55 v64.77,81.28 | v149.86,78.74 151.13,77.47 BUS.3
  Bottom 0.406: IC6.2 63.5,72.39 64.77,73.66 v64.77,81.28 | v146.05,82.55 v149.86,78.74
CLOCK14  (via drill 0.61)
  Top 0.406: v109.22,83.82 152.4,83.82 154.94,81.28 154.94,78.74 BUS.4
  Bottom 0.406: IC5.5 101.6,50.8 102.87,52.07 102.87,62.23 110.49,69.85 110.49,82.55 v109.22,83.82
CPL  (via drill 0.61)
  Top 0.406: UROM1.18 44.45,54.61 46.99,52.07 52.07,52.07 54.61,49.53 v54.61,45.72 | v54.61,27.94 54.61,24.13 69.85,8.89 SV3.11
  Bottom 0.406: UROM1.18 RN3.5 | v54.61,27.94 v54.61,45.72
DBUS0
  Top 0.406: IC9.18 134.62,64.77 151.13,64.77 BUS.11
DBUS1
  Top 0.406: IC9.17 135.89,63.5 152.4,63.5 BUS.13
DBUS2
  Top 0.406: IC9.16 137.16,62.23 BUS.15
DBUS3
  Top 0.406: IC9.15 138.43,60.96 152.4,60.96 BUS.17
DBUS4
  Top 0.406: IC9.14 139.7,59.69 151.13,59.69 BUS.19
DBUS5
  Top 0.406: IC9.13 140.97,58.42 149.86,58.42 BUS.21
DBUS6
  Top 0.406: IC9.12 142.24,57.15 148.59,57.15 BUS.23
DBUS7
  Top 0.406: IC9.11 143.51,55.88 147.32,55.88 BUS.25
DBUS8
  Top 0.406: IC10.18 134.62,41.91 146.05,41.91 151.13,46.99 BUS.27
DBUS9
  Top 0.406: IC10.17 135.89,40.64 147.32,40.64 151.13,44.45 BUS.29
DBUS10
  Top 0.406: IC10.16 137.16,39.37 148.59,39.37 151.13,41.91 BUS.31
DBUS11
  Top 0.406: IC10.15 138.43,38.1 149.86,38.1 151.13,39.37 BUS.33
DBUS12
  Top 0.406: IC10.14 139.7,36.83 BUS.35
DBUS13
  Top 0.406: IC10.13 140.97,35.56 149.86,35.56 151.13,34.29 BUS.37
DBUS14
  Top 0.406: IC10.12 142.24,34.29 148.59,34.29 151.13,31.75 BUS.39
DBUS15
  Top 0.406: IC10.11 148.59,31.75 152.4,27.94 154.94,27.94 BUS.41
GND  (via drill 0.61)  (1 unrouted)
  Top 0.406: 93.98,78.74 95.25,80.01 97.79,80.01 99.06,78.74 IC1.11 | IC11.12 124.46,78.74 125.73,80.01 128.27,80.01 129.54,78.74 IC11.10 | IC5.4 99.06,45.72 100.33,44.45 107.95,44.45 109.22,45.72 | v106.68,85.09 v123.19,85.09 | 109.22,45.72 IC5.8 | 109.22,45.72 110.49,44.45 v115.57,44.45 | UROM1.28 19.05,59.69 20.32,60.96 31.75,60.96 UROM1.22 | UROM2.28 19.05,86.36 20.32,87.63 33.02,87.63 34.29,86.36 UROM2.22 | 93.98,78.74 IC1.13 | 93.98,78.74 92.71,80.01 86.36,80.01 85.09,78.74 85.09,76.2 86.36,74.93 C11.1 | 142.24,45.72 IC9.10 142.24,49.53 140.97,50.8 116.84,50.8 C13.1
  Top 0.813: IC2.7 113.03,24.13 v115.57,26.67 143.51,26.67 v146.05,24.13 | v78.74,66.04 IC6.8 | v83.82,54.61 v83.82,63.5
  Top 1.016: v104.14,66.04 v116.84,66.04
  Bottom 0.406: C1.1 5.08,20.32 UROM0.1 UROM0.2 UROM0.3 13.97,13.97 15.24,12.7 | UROM1.30 UROM2.3 | UROM2.30 UROM2.29 | IC6.6 IC6.5 IC6.4 IC6.3 | UROM1.29 16.51,46.99 17.78,45.72 17.78,40.64 16.51,39.37 UROM0.29 16.51,20.32 17.78,19.05 17.78,13.97 20.32,13.97 20.32,21.59 19.05,22.86 UROM0.28 19.05,39.37 20.32,40.64 20.32,46.99 19.05,48.26 UROM1.28 | v116.84,66.04 115.57,67.31 | 35.56,14.89 35.56,15.24
  other vias: 116.84,24.13
  pour Bottom (isolate 0.508, no thermals): 30.48,8.89 29.21,7.62 29.21,5.08 30.48,3.81 33.02,3.81 34.29,5.08 34.29,7.62 33.02,8.89
  pour Bottom (isolate 0.61, no thermals): 0,100.33 0,0 160.02,0 160.02,100.33
GUARDPULSE  (via drill 0.61)
  Top 0.406: v91.44,21.59 92.71,20.32 97.79,20.32 v99.06,21.59 | IC2.4 104.14,29.21 IC2.9
  Bottom 0.406: IC2.4 v99.06,21.59 99.06,6.35 SV3.34 | v91.44,21.59 IC2.1
IBUS0
  Bottom 0.406: IC9.2 121.92,41.91 123.19,40.64 123.19,6.35 IBUS.2
IBUS1
  Bottom 0.406: IC9.3 124.46,44.45 125.73,43.18 125.73,6.35 IBUS.4
IBUS2
  Bottom 0.406: IC9.4 127,41.91 128.27,40.64 128.27,6.35 IBUS.6
IBUS3
  Bottom 0.406: IC9.5 129.54,44.45 130.81,43.18 130.81,6.35 IBUS.8
IBUS4
  Bottom 0.406: IC9.6 132.08,44.45 133.35,43.18 133.35,6.35 IBUS.10
IBUS5
  Bottom 0.406: IC9.7 134.62,44.45 135.89,43.18 135.89,6.35 IBUS.12
IBUS6
  Bottom 0.406: IC9.8 137.16,44.45 138.43,43.18 138.43,6.35 IBUS.14
IBUS7
  Bottom 0.406: IC9.9 139.7,44.45 140.97,43.18 140.97,6.35 IBUS.16
IBUS8
  Bottom 0.406: IBUS.1 IC10.2
IBUS9
  Bottom 0.406: IBUS.3 IC10.3
IBUS10
  Bottom 0.406: IBUS.5 IC10.4
IBUS11
  Bottom 0.406: IBUS.7 IC10.5
IBUS12
  Bottom 0.406: IBUS.9 IC10.6
IBUS13
  Bottom 0.406: IBUS.11 IC10.7
IBUS14
  Bottom 0.406: IBUS.13 IC10.8
IBUS15
  Bottom 0.406: IBUS.15 IC10.9
IR11
  Top 0.406: UROM1.6 21.59,40.64 17.78,36.83 CU2.4
  Bottom 0.406: UROM0.6 21.59,21.59 20.32,22.86 20.32,39.37 21.59,40.64 UROM1.6 21.59,54.61 20.32,55.88 20.32,66.04 21.59,67.31 UROM2.6
IR12
  Top 0.406: UROM1.5 19.05,40.64 17.78,39.37 CU2.3
  Bottom 0.406: UROM0.5 19.05,20.32 17.78,21.59 17.78,39.37 19.05,40.64 UROM1.5 19.05,46.99 17.78,48.26 17.78,66.04 19.05,67.31 UROM2.5
IR13  (via drill 0.61)
  Top 0.406: 21.59,83.82 UROM2.27 21.59,82.55 20.32,81.28 v12.7,81.28
  Bottom 0.406: UROM2.27 21.59,82.55 22.86,81.28 22.86,67.31 21.59,66.04 UROM1.27 21.59,55.88 22.86,54.61 22.86,40.64 21.59,39.37 UROM0.27 | v12.7,81.28 7.62,81.28 3.81,77.47 3.81,63.5 CU1.2
IR14  (via drill 0.61)
  Top 0.406: v11.43,80.01 21.59,80.01 24.13,82.55 UROM2.26
  Bottom 0.406: UROM2.26 24.13,82.55 25.4,81.28 25.4,67.31 24.13,66.04 UROM1.26 24.13,55.88 25.4,54.61 25.4,40.64 24.13,39.37 UROM0.26 | v11.43,80.01 8.89,80.01 5.08,76.2 CU1.1
IR15  (via drill 0.61)
  Top 0.406: UROM2.23 31.75,82.55 | v10.16,66.04 30.48,66.04 v31.75,64.77
  Bottom 0.406: UROM2.23 31.75,82.55 33.02,81.28 33.02,67.31 31.75,66.04 v31.75,64.77 UROM1.23 31.75,55.88 33.02,54.61 33.02,40.64 31.75,39.37 UROM0.23 | v10.16,66.04 8.89,66.04 CU1.3
N$1  (via drill 0.61)
  Top 0.406: v87.63,96.52 93.98,90.17 v93.98,86.36
  Bottom 0.406: UROM0.24 29.21,39.37 30.48,40.64 30.48,54.61 29.21,55.88 UROM1.24 29.21,66.04 30.48,67.31 30.48,81.28 29.21,82.55 UROM2.24 29.21,90.17 35.56,96.52 v87.63,96.52 | IC1.2 93.98,73.66 92.71,74.93 92.71,85.09 v93.98,86.36
N$2
  Top 0.406: IC11.6 132.08,64.77 IC9.19
  Bottom 0.406: IC9.19 121.92,50.8 120.65,49.53 120.65,40.64 121.92,39.37 IC10.19
N$3  (via drill 0.61)
  Top 0.406: IC2.2 93.98,25.4 92.71,26.67 92.71,33.02 93.98,34.29 93.98,41.91 97.79,45.72 v97.79,63.5
  Bottom 0.406: IC7.13 68.58,60.96 74.93,67.31 93.98,67.31 v97.79,63.5
N$4  (via drill 0.61)
  Top 0.406: v96.52,41.91 96.52,36.83 100.33,33.02 100.33,30.48 v101.6,29.21
  Bottom 0.406: v96.52,41.91 95.25,43.18 95.25,49.53 97.79,52.07 97.79,57.15 96.52,58.42 80.01,58.42 78.74,57.15 IC7.9 | IC2.5 v101.6,29.21
N$7  (via drill 0.61)
  Top 0.406: v101.6,59.69 105.41,59.69 107.95,57.15 v107.95,52.07 | v109.22,43.18 107.95,41.91 104.14,41.91 101.6,39.37 v101.6,36.83
  Bottom 0.406: IC7.7 76.2,50.8 77.47,52.07 77.47,58.42 78.74,59.69 v101.6,59.69 | v107.95,52.07 107.95,44.45 v109.22,43.18 | v101.6,36.83 IC2.10
OP_IF0
  Top 0.406: UROM0.21 36.83,30.48 38.1,29.21 38.1,11.43 39.37,10.16 58.42,10.16 59.69,8.89 SV3.3
  Bottom 0.406: UROM0.21 RN5.2
OP_IF1  (via drill 0.61)
  Top 0.406: v46.99,22.86 48.26,22.86 62.23,8.89 SV3.5
  Bottom 0.406: UROM1.13 39.37,41.91 RN4.2 43.18,38.1 43.18,29.21 46.99,25.4 v46.99,22.86
OP_IF2  (via drill 0.61)
  Top 0.406: v48.26,24.13 63.5,8.89 63.5,6.35 SV3.6
  Bottom 0.406: UROM1.14 41.91,41.91 RN4.3 45.72,38.1 45.72,29.21 48.26,26.67 v48.26,24.13
OP_IF3  (via drill 0.61)
  Top 0.406: v49.53,25.4 49.53,24.13 64.77,8.89 SV3.7
  Bottom 0.406: UROM1.15 44.45,41.91 RN4.4 48.26,38.1 48.26,29.21 49.53,27.94 v49.53,25.4
R_UNIT0  (via drill 0.6)
  Top 0.406: UROM0.13 39.37,19.05 v41.91,21.59 | v60.96,38.1 58.42,35.56 57.15,35.56 55.88,34.29 55.88,30.48 58.42,27.94 58.42,24.13 71.12,11.43 v72.39,11.43
  Bottom 0.406: RN6.2 UROM0.13 | SV3.16 76.2,6.35 76.2,8.89 73.66,11.43 v72.39,11.43 | v60.96,38.1 60.96,40.64 64.77,44.45 64.77,48.26 63.5,49.53 62.23,49.53 60.96,48.26 IC7.1 60.96,44.45 58.42,41.91 58.42,35.56 57.15,34.29 57.15,24.13 54.61,21.59 v41.91,21.59
R_UNIT1  (via drill 0.6)
  Top 0.406: UROM0.14 41.91,19.05 43.18,20.32 v44.45,20.32 45.72,19.05 45.72,13.97 46.99,12.7 v57.15,12.7
  Bottom 0.406: RN6.3 UROM0.14 | IC7.2 63.5,44.45 59.69,40.64 59.69,35.56 58.42,34.29 58.42,24.13 54.61,20.32 v44.45,20.32 | SV3.18 78.74,6.35 78.74,8.89 74.93,12.7 v57.15,12.7
R_UNIT2  (via drill 0.6)
  Top 0.406: v73.66,13.97 69.85,13.97 59.69,24.13 59.69,27.94 57.15,30.48 57.15,33.02 59.69,35.56 v60.96,35.56 | v48.26,11.43 v55.88,11.43
  Bottom 0.406: UROM0.15 RN6.4 45.72,11.43 v48.26,11.43 | v73.66,13.97 76.2,13.97 81.28,8.89 81.28,6.35 SV3.20 77.47,2.54 64.77,2.54 63.5,3.81 63.5,8.89 60.96,11.43 v55.88,11.43 | v60.96,35.56 62.23,36.83 62.23,40.64 66.04,44.45 IC7.3
R_UNIT3  (via drill 0.6)
  Top 0.406: IC7.5 71.12,45.72 68.58,43.18 v67.31,43.18 57.15,43.18 49.53,35.56 RN5.6 | v63.5,36.83 63.5,35.56 62.23,34.29 59.69,34.29 58.42,33.02 58.42,30.48 60.96,27.94 60.96,24.13 69.85,15.24 v72.39,15.24
  Bottom 0.406: UROM0.17 RN5.6 | SV3.22 83.82,6.35 83.82,8.89 76.2,16.51 73.66,16.51 v72.39,15.24 | v67.31,43.18 66.04,43.18 63.5,40.64 v63.5,36.83
UNUSED1
  Bottom 0.406: UROM2.15 44.45,68.58 RN2.4
UPC0  (via drill 0.61)
  Top 0.406: IC6.14 66.04,78.74 64.77,80.01 45.72,80.01 44.45,78.74 v44.45,77.47 | UROM0.12 v36.83,27.94
  Bottom 0.406: v36.83,27.94 35.56,29.21 35.56,39.37 36.83,40.64 UROM1.12 36.83,55.88 35.56,57.15 35.56,66.04 36.83,67.31 UROM2.12 36.83,74.93 38.1,76.2 43.18,76.2 v44.45,77.47
UPC1
  Bottom 0.406: UROM0.11 34.29,19.05 33.02,20.32 33.02,39.37 34.29,40.64 UROM1.11 34.29,54.61 33.02,55.88 33.02,66.04 34.29,67.31 UROM2.11 34.29,74.93 38.1,78.74 55.88,78.74 60.96,83.82 67.31,83.82 68.58,82.55 IC6.13
UPC2  (via drill 0.61)
  Top 0.406: v31.75,74.93 v36.83,80.01
  Bottom 0.406: UROM0.10 31.75,19.05 30.48,20.32 30.48,39.37 31.75,40.64 UROM1.10 31.75,54.61 30.48,55.88 30.48,66.04 31.75,67.31 UROM2.10 v31.75,74.93 | v36.83,80.01 54.61,80.01 59.69,85.09 69.85,85.09 71.12,83.82 IC6.12
UPC3  (via drill 0.61)
  Top 0.406: v29.21,74.93 v35.56,81.28
  Bottom 0.406: UROM0.9 29.21,19.05 27.94,20.32 27.94,39.37 29.21,40.64 UROM1.9 29.21,54.61 27.94,55.88 27.94,66.04 29.21,67.31 UROM2.9 v29.21,74.93 | v35.56,81.28 53.34,81.28 58.42,86.36 72.39,86.36 73.66,85.09 IC6.11
VCC  (via drill 0.6, 0.61)
  Top 0.406: 20.32,3.81 POWER.2 | 22.86,3.81 POWER.4 | IC7.6 73.66,48.26 72.39,49.53
  Top 0.61: UROM0.32 UROM0.31 | UROM1.32 UROM1.31 11.43,60.96 | UROM2.32 UROM2.31 | UROM2.31 11.43,87.63 12.7,88.9 RN1.1 | RN3.1 34.29,64.77 35.56,66.04 RN2.1 | RN5.1 34.29,38.1 35.56,39.37 RN4.1 | UROM2.31 11.43,82.55
  Top 0.813: C4.2 UROM2.32 | C3.2 UROM1.32 | C1.2 UROM0.32 | C14.2 IC11.14 119.38,80.01 120.65,81.28 | POWER.4 22.86,10.16 24.13,11.43 35.56,11.43 RN6.1 | 22.86,3.81 24.13,2.54 | 78.74,49.53 88.9,49.53 | IC9.20 119.38,53.34 | C12.2 IC10.20 119.38,29.21 120.65,27.94 v146.05,27.94 148.59,25.4 | 146.05,2.54 148.59,5.08 | 88.9,26.67 91.44,29.21 IC2.14 C9.2 | C10.2 87.63,55.88 | v146.05,48.26 144.78,49.53 | C6.2 IC7.16 | C8.2 IC6.16 | IC5.6 104.14,48.26
  Top 1.27: C7.+ 13.97,2.54 19.05,2.54 20.32,3.81
  Bottom 0.813: v146.05,48.26 148.59,45.72 148.59,30.48 v146.05,27.94 | v100.33,62.23 99.06,60.96 v93.98,60.96
  Bottom 1.016: v71.12,17.78 68.58,15.24 55.88,15.24 52.07,11.43 v52.07,7.62
  pour Top (isolate 0.508, no thermals): 20.32,8.89 19.05,7.62 19.05,5.08 20.32,3.81 22.86,3.81 24.13,5.08 24.13,7.62 22.86,8.89
  pour Top (isolate 0.61, no thermals): 0,100.33 0,0 160.02,0 160.02,100.33
W_UNIT0
  Top 0.406: IC5.1 81.28,46.99 78.74,44.45 71.12,44.45 68.58,41.91 57.15,41.91 50.8,35.56 50.8,31.75 48.26,29.21 44.45,29.21 UROM0.18
  Bottom 0.406: UROM0.18 RN5.5
W_UNIT1
  Top 0.406: IC5.2 93.98,45.72 92.71,44.45 90.17,44.45 88.9,45.72 81.28,45.72 78.74,43.18 71.12,43.18 68.58,40.64 57.15,40.64 52.07,35.56 52.07,31.75 48.26,27.94 43.18,27.94 41.91,29.21 UROM0.19
  Bottom 0.406: UROM0.19 RN5.4
W_UNIT2
  Top 0.406: IC5.3 96.52,45.72 93.98,43.18 90.17,43.18 88.9,44.45 81.28,44.45 78.74,41.91 71.12,41.91 68.58,39.37 57.15,39.37 53.34,35.56 53.34,31.75 48.26,26.67 41.91,26.67 39.37,29.21 UROM0.20
  Bottom 0.406: UROM0.20 RN5.3

### Text on the board
Top: (c) 2011 AlexiosC
Bottom: (c) 2011 AlexiosC
tNames: (c) 2011 AlexiosC | CFT CPU Sequencer/Data bus drv Rev C
tValues: +12V | +5V | GND